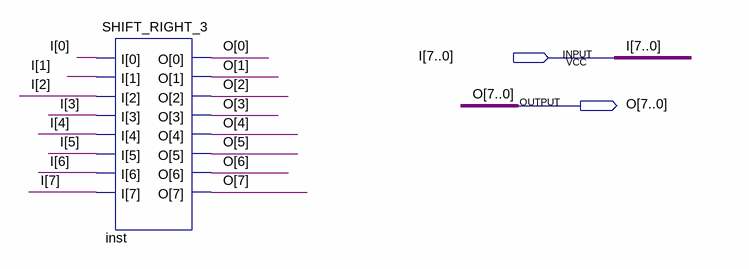
[diagram p0: schematic sheet]
// Quartus schematic shift_R_3.bdf as structural Verilog: 1 symbols, 2 pins
module shift_R_3 (
  input  [7:0] I,
  output [7:0] O
);

  SHIFT_RIGHT_3 inst (.I(I), .O(O));
endmodule
